# Altium schematic sheet NeopixelNetwork.SchDoc: Neopixel array
size A4
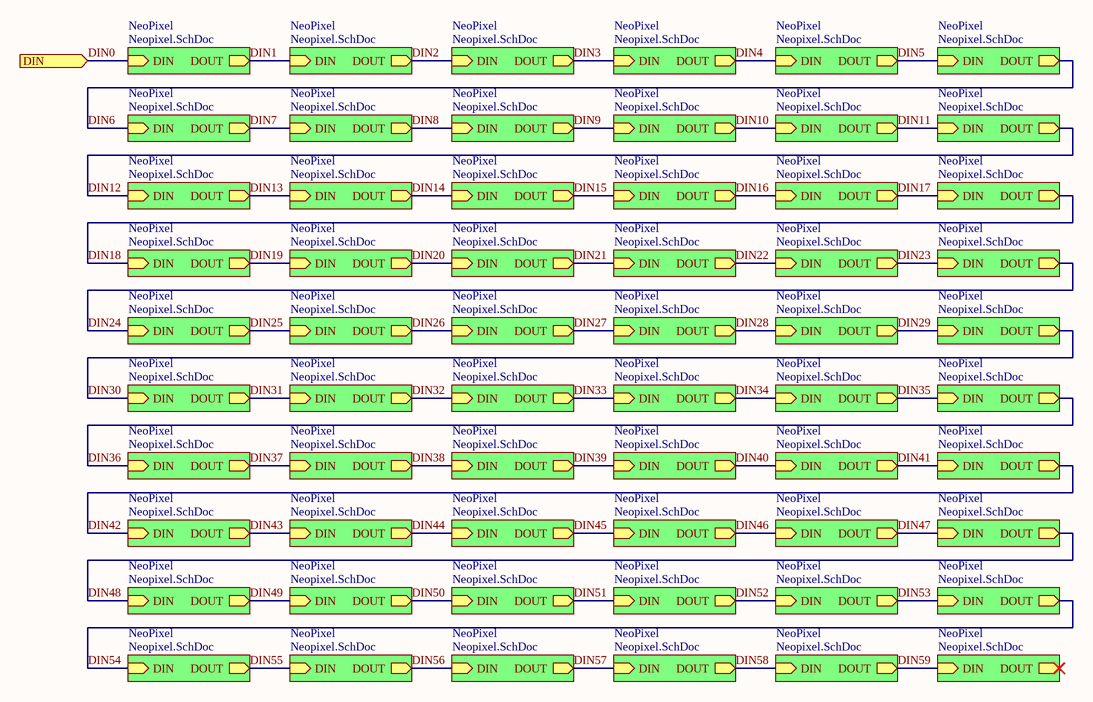
[diagram p0: NeopixelNetwork.SchDoc]

## Sub-sheets
NeoPixel = Neopixel.SchDoc: DIN (in), DOUT (out)
NeoPixel = Neopixel.SchDoc: DIN (in), DOUT (out)
NeoPixel = Neopixel.SchDoc: DIN (in), DOUT (out)
NeoPixel = Neopixel.SchDoc: DIN (in), DOUT (out)
NeoPixel = Neopixel.SchDoc: DIN (in), DOUT (out)
NeoPixel = Neopixel.SchDoc: DIN (in), DOUT (out)
NeoPixel = Neopixel.SchDoc: DIN (in), DOUT (out)
NeoPixel = Neopixel.SchDoc: DIN (in), DOUT (out)
NeoPixel = Neopixel.SchDoc: DIN (in), DOUT (out)
NeoPixel = Neopixel.SchDoc: DIN (in), DOUT (out)
NeoPixel = Neopixel.SchDoc: DIN (in), DOUT (out)
NeoPixel = Neopixel.SchDoc: DIN (in), DOUT (out)
NeoPixel = Neopixel.SchDoc: DIN (in), DOUT (out)
NeoPixel = Neopixel.SchDoc: DIN (in), DOUT (out)
NeoPixel = Neopixel.SchDoc: DIN (in), DOUT (out)
NeoPixel = Neopixel.SchDoc: DIN (in), DOUT (out)
NeoPixel = Neopixel.SchDoc: DIN (in), DOUT (out)
NeoPixel = Neopixel.SchDoc: DIN (in), DOUT (out)
NeoPixel = Neopixel.SchDoc: DIN (in), DOUT (out)
NeoPixel = Neopixel.SchDoc: DIN (in), DOUT (out)
NeoPixel = Neopixel.SchDoc: DIN (in), DOUT (out)
NeoPixel = Neopixel.SchDoc: DIN (in), DOUT (out)
NeoPixel = Neopixel.SchDoc: DIN (in), DOUT (out)
NeoPixel = Neopixel.SchDoc: DIN (in), DOUT (out)
NeoPixel = Neopixel.SchDoc: DIN (in), DOUT (out)
NeoPixel = Neopixel.SchDoc: DIN (in), DOUT (out)
NeoPixel = Neopixel.SchDoc: DIN (in), DOUT (out)
NeoPixel = Neopixel.SchDoc: DIN (in), DOUT (out)
NeoPixel = Neopixel.SchDoc: DIN (in), DOUT (out)
NeoPixel = Neopixel.SchDoc: DIN (in), DOUT (out)
NeoPixel = Neopixel.SchDoc: DIN (in), DOUT (out)
NeoPixel = Neopixel.SchDoc: DIN (in), DOUT (out)
NeoPixel = Neopixel.SchDoc: DIN (in), DOUT (out)
NeoPixel = Neopixel.SchDoc: DIN (in), DOUT (out)
NeoPixel = Neopixel.SchDoc: DIN (in), DOUT (out)
NeoPixel = Neopixel.SchDoc: DIN (in), DOUT (out)
NeoPixel = Neopixel.SchDoc: DIN (in), DOUT (out)
NeoPixel = Neopixel.SchDoc: DIN (in), DOUT (out)
NeoPixel = Neopixel.SchDoc: DIN (in), DOUT (out)
NeoPixel = Neopixel.SchDoc: DIN (in), DOUT (out)
NeoPixel = Neopixel.SchDoc: DIN (in), DOUT (out)
NeoPixel = Neopixel.SchDoc: DIN (in), DOUT (out)
NeoPixel = Neopixel.SchDoc: DIN (in), DOUT (out)
NeoPixel = Neopixel.SchDoc: DIN (in), DOUT (out)
NeoPixel = Neopixel.SchDoc: DIN (in), DOUT (out)
NeoPixel = Neopixel.SchDoc: DIN (in), DOUT (out)
NeoPixel = Neopixel.SchDoc: DIN (in), DOUT (out)
NeoPixel = Neopixel.SchDoc: DIN (in), DOUT (out)
NeoPixel = Neopixel.SchDoc: DIN (in), DOUT (out)
NeoPixel = Neopixel.SchDoc: DIN (in), DOUT (out)
NeoPixel = Neopixel.SchDoc: DIN (in), DOUT (out)
NeoPixel = Neopixel.SchDoc: DIN (in), DOUT (out)
NeoPixel = Neopixel.SchDoc: DIN (in), DOUT (out)
NeoPixel = Neopixel.SchDoc: DIN (in), DOUT (out)
NeoPixel = Neopixel.SchDoc: DIN (in), DOUT (out)
NeoPixel = Neopixel.SchDoc: DIN (in), DOUT (out)
NeoPixel = Neopixel.SchDoc: DIN (in), DOUT (out)
NeoPixel = Neopixel.SchDoc: DIN (in), DOUT (out)
NeoPixel = Neopixel.SchDoc: DIN (in), DOUT (out)
NeoPixel = Neopixel.SchDoc: DIN (in), DOUT (out)

## Ports
DIN (in)

## Nets
DIN0: port DIN, sheet NeoPixel/DIN
DIN1: sheet NeoPixel/DOUT, sheet NeoPixel/DIN
DIN2: sheet NeoPixel/DOUT, sheet NeoPixel/DIN
DIN3: sheet NeoPixel/DOUT, sheet NeoPixel/DIN
DIN4: sheet NeoPixel/DOUT, sheet NeoPixel/DIN
DIN5: sheet NeoPixel/DOUT, sheet NeoPixel/DIN
DIN6: sheet NeoPixel/DOUT, sheet NeoPixel/DIN
DIN7: sheet NeoPixel/DOUT, sheet NeoPixel/DIN
DIN8: sheet NeoPixel/DOUT, sheet NeoPixel/DIN
DIN9: sheet NeoPixel/DOUT, sheet NeoPixel/DIN
DIN10: sheet NeoPixel/DOUT, sheet NeoPixel/DIN
DIN11: sheet NeoPixel/DOUT, sheet NeoPixel/DIN
DIN12: sheet NeoPixel/DOUT, sheet NeoPixel/DIN
DIN13: sheet NeoPixel/DOUT, sheet NeoPixel/DIN
DIN14: sheet NeoPixel/DOUT, sheet NeoPixel/DIN
DIN15: sheet NeoPixel/DOUT, sheet NeoPixel/DIN
DIN16: sheet NeoPixel/DOUT, sheet NeoPixel/DIN
DIN17: sheet NeoPixel/DOUT, sheet NeoPixel/DIN
DIN18: sheet NeoPixel/DOUT, sheet NeoPixel/DIN
DIN19: sheet NeoPixel/DOUT, sheet NeoPixel/DIN
DIN20: sheet NeoPixel/DOUT, sheet NeoPixel/DIN
DIN21: sheet NeoPixel/DOUT, sheet NeoPixel/DIN
DIN22: sheet NeoPixel/DOUT, sheet NeoPixel/DIN
DIN23: sheet NeoPixel/DOUT, sheet NeoPixel/DIN
DIN24: sheet NeoPixel/DOUT, sheet NeoPixel/DIN
DIN25: sheet NeoPixel/DOUT, sheet NeoPixel/DIN
DIN26: sheet NeoPixel/DOUT, sheet NeoPixel/DIN
DIN27: sheet NeoPixel/DOUT, sheet NeoPixel/DIN
DIN28: sheet NeoPixel/DOUT, sheet NeoPixel/DIN
DIN29: sheet NeoPixel/DOUT, sheet NeoPixel/DIN
DIN30: sheet NeoPixel/DOUT, sheet NeoPixel/DIN
DIN31: sheet NeoPixel/DOUT, sheet NeoPixel/DIN
DIN32: sheet NeoPixel/DOUT, sheet NeoPixel/DIN
DIN33: sheet NeoPixel/DOUT, sheet NeoPixel/DIN
DIN34: sheet NeoPixel/DOUT, sheet NeoPixel/DIN
DIN35: sheet NeoPixel/DOUT, sheet NeoPixel/DIN
DIN36: sheet NeoPixel/DOUT, sheet NeoPixel/DIN
DIN37: sheet NeoPixel/DOUT, sheet NeoPixel/DIN
DIN38: sheet NeoPixel/DOUT, sheet NeoPixel/DIN
DIN39: sheet NeoPixel/DOUT, sheet NeoPixel/DIN
DIN40: sheet NeoPixel/DOUT, sheet NeoPixel/DIN
DIN41: sheet NeoPixel/DOUT, sheet NeoPixel/DIN
DIN42: sheet NeoPixel/DOUT, sheet NeoPixel/DIN
DIN43: sheet NeoPixel/DOUT, sheet NeoPixel/DIN
DIN44: sheet NeoPixel/DOUT, sheet NeoPixel/DIN
DIN45: sheet NeoPixel/DOUT, sheet NeoPixel/DIN
DIN46: sheet NeoPixel/DOUT, sheet NeoPixel/DIN
DIN47: sheet NeoPixel/DOUT, sheet NeoPixel/DIN
DIN48: sheet NeoPixel/DOUT, sheet NeoPixel/DIN
DIN49: sheet NeoPixel/DOUT, sheet NeoPixel/DIN
DIN50: sheet NeoPixel/DOUT, sheet NeoPixel/DIN
DIN51: sheet NeoPixel/DOUT, sheet NeoPixel/DIN
DIN52: sheet NeoPixel/DOUT, sheet NeoPixel/DIN
DIN53: sheet NeoPixel/DOUT, sheet NeoPixel/DIN
DIN54: sheet NeoPixel/DOUT, sheet NeoPixel/DIN
DIN55: sheet NeoPixel/DOUT, sheet NeoPixel/DIN
DIN56: sheet NeoPixel/DOUT, sheet NeoPixel/DIN
DIN57: sheet NeoPixel/DOUT, sheet NeoPixel/DIN
DIN58: sheet NeoPixel/DOUT, sheet NeoPixel/DIN
DIN59: sheet NeoPixel/DOUT, sheet NeoPixel/DIN

## Notes on the sheet
- Title
- Size:
- Date:
- A4
- Number:
- Time:
- Revision:
- Sheet
- of
- File: